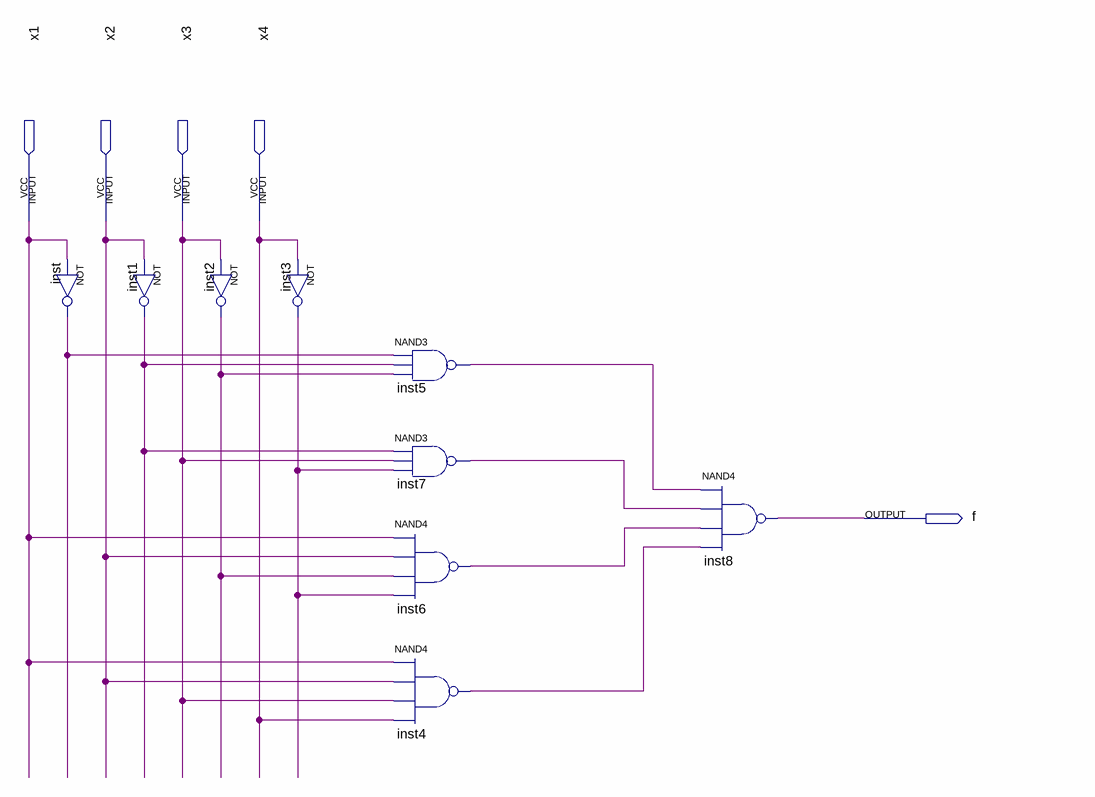
[diagram p0: schematic sheet]
// Quartus schematic Lab2.bdf as structural Verilog: 9 symbols, 5 pins
module Lab2 (
  input  x1,
  input  x2,
  input  x3,
  input  x4,
  output f
);

  wire inst1_out, inst2_out, inst3_out, inst4_out, inst5_out, inst6_out, inst7_out, inst_out;

  not inst (inst_out, x1);
  not inst1 (inst1_out, x2);
  not inst2 (inst2_out, x3);
  not inst3 (inst3_out, x4);
  nand inst5 (inst5_out, inst_out, inst1_out, inst2_out);
  nand inst7 (inst7_out, inst1_out, x3, inst3_out);
  nand inst6 (inst6_out, x1, x2, inst2_out, inst3_out);
  nand inst4 (inst4_out, x1, x2, x3, x4);
  nand inst8 (f, inst5_out, inst7_out, inst6_out, inst4_out);
endmodule
